# Altium project current_sense.PrjPcb
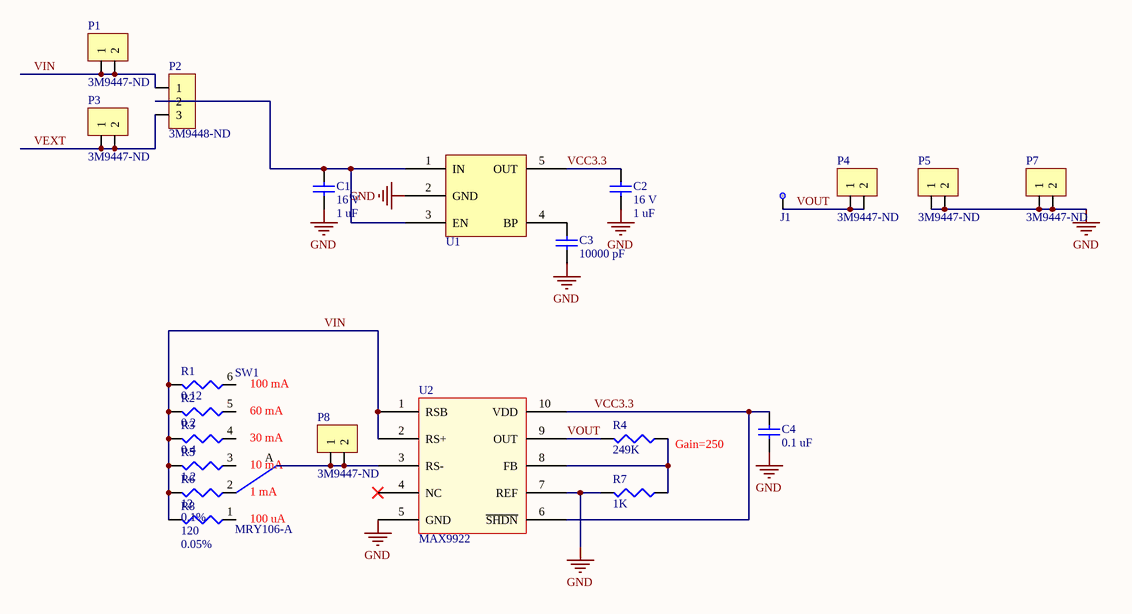
[diagram p0: current_sense.SchDoc]
1 sheet, 23 parts. Net scope: global (net labels, ports and power ports of the same name join across sheets).
Board file: current_sense_v2.PcbDoc

## Sheet current_sense.SchDoc: Current Sense
size Letter; Author: Ye-Sheng Kuo; Revision: 2

### Parts
C1  value 1 uF  voltage rated: 16 V  [0603]  (hidden comment: Ceramic capacitor)
C2  value 1 uF  voltage rated: 16 V  [0603]  (hidden comment: Ceramic capacitor)
C3  value 10000 pF  [0603]  (hidden comment: Ceramic capacitor)
C4  value 0.1 uF  [0603]  (hidden comment: Ceramic capacitor)
J1  5004  [TestPoint]  (value not drawn)
P1  Supplier Part Number 1: 3M9447-ND  [1x2 header]  (hidden comment: 1 x 2 header)
P2  Supplier Part Number 1: 3M9448-ND  [1x3 header]  (hidden comment: 1 x 3 header)
P3  Supplier Part Number 1: 3M9447-ND  [1x2 header]  (hidden comment: 1 x 2 header)
P4  Supplier Part Number 1: 3M9447-ND  [1x2 header]  (hidden comment: 1 x 2 header)
P5  Supplier Part Number 1: 3M9447-ND  [1x2 header]  (hidden comment: 1 x 2 header)
P7  Supplier Part Number 1: 3M9447-ND  [1x2 header]  (hidden comment: 1 x 2 header)
P8  Supplier Part Number 1: 3M9447-ND  [1x2 header]  (hidden comment: 1 x 2 header)
R1  value 0.12  [1206]  (hidden comment: Chip resistor)
R2  value 0.2  [1206]  (hidden comment: Chip resistor)
R3  value 0.4  [1206]  (hidden comment: Chip resistor)
R4  value 249K  [0603]  (hidden comment: Chip resistor)
R5  value 1.2  [0805]  (hidden comment: Chip resistor)
R6  value 12  Tolerance: 0.1%  [0805]  (hidden comment: Chip resistor)
R7  value 1K  [0603]  (hidden comment: Chip resistor)
R8  value 120  Tolerance: 0.05%  [0805]  (hidden comment: Chip resistor)
SW1  MRY106-A  [MRY switch]
U1  LP3985  [SOT23-5]  (value not drawn)
U2  MAX9922  [10umax]

### Nets
GND: C1.2 C2.2 C3.2 C4.2 P5.1 P5.2 P7.1 P7.2 R7.1 U1.2(GND) U2.5(GND) U2.7(REF)
VCC3.3: C2.1 C4.1 U1.5(OUT) U2.6(~{SHDN}) U2.10(VDD)
VEXT: P2.3 P3.1 P3.2
VIN: P1.1 P1.2 P2.1 R1.1 R2.1 R3.1 R5.1 R6.1 R8.1 U2.1(RSB) U2.2(RS+)
VOUT: J1.1(TB) P4.1 P4.2 R4.1 U2.9(OUT)
NetC1_1: C1.1 P2.2 U1.1(IN) U1.3(EN)
NetC3_1: C3.1 U1.4(BP)
NetP8_1: P8.1 P8.2 SW1.A U2.3(RS-)
NetR1_2: R1.2 SW1.6
NetR2_2: R2.2 SW1.5
NetR3_2: R3.2 SW1.4
NetR4_2: R4.2 R7.2 U2.8(FB)
NetR5_2: R5.2 SW1.3
NetR6_2: R6.2 SW1.2
NetR8_2: R8.2 SW1.1

Not connected (* = marked no-connect by the designer): U2 4(NC)*

### Notes on the sheet
- (near SW1) 100 mA
- (near SW1) 60 mA
- (near SW1) 30 mA
- (near R4) Gain=250
- (near SW1) 10 mA
- (near SW1) 1 mA
- (near SW1) 100 uA
- Title
- Date:
- Author:
- Revision:
- Sheet
- of
- University of Michigan
- File:

### Library data of the parts
C1 C2 = C_1u_16V_0603_ceramic: Ceramic capacitor, 1 uF, 16 V, 0603 package; Manufacture: TDK; tolerance: 10%; package: 0603; Supplier 1: Digi-Key; Supplier Part Number 1: 445-1604-1-ND
C3 = C_10000p_25V_0603_ceramic: Ceramic capacitor, 10000 pF, 0603 package; Manufacture: TDK; voltage rated: 25V; tolerance: 10%; package: 0603; Supplier 1: Digi-Key; Supplier Part Number 1: 445-5100-1-ND
C4 = C_0.1u_25V_0603_ceramic: Ceramic capacitor, 0.1 uF, 0603 package; Manufacture: TDK; voltage rated: 25V; tolerance: 10%; package: 0603; Supplier 1: Digi-Key; Supplier Part Number 1: 445-1316-1-ND
J1 = TestPoint: TEST POINT PC MINI .040"D YELLOW; Supplier 1: Digi-Key; Supplier Part Number 1: 5004K-ND; datasheet: http://mail.keyelco.com/ENG._DEPT/PDF%20CAT%20NO%20Drawings/5004.pdf
P1 P3-P5 P7 P8 = 1 x 2 header: 100 mils standard header; Supplier 1: Digi-Key
P2 = 1 x 3 header: 100 mils standard header; Supplier 1: Digi-Key
R1 = R_0.12_1206_1%: Chip resistor, 0.12, 1206 package, current sense; tolerance: 1%; power: 0.5 W; Temperature Coef: 100 ppm; package: 1206; Supplier 1: Digi-Key; Supplier Part Number 1: RL16R.12FCT-ND
R2 = R_0.2_1206_1%: Chip resistor, 0.2, 1206 package, current sense; tolerance: 1%; power: 0.5 W; Temperature Coef: 100 ppm; package: 1206; Supplier 1: Digi-Key; Supplier Part Number 1: CSR1206FKR200CT-ND
R3 = R_0.4_1206_1%: Chip resistor, 0.4, 1206 package, current sense; tolerance: 1%; power: 0.25 W; Temperature Coef: 300 ppm; package: 1206; Supplier 1: Digi-Key; Supplier Part Number 1: 311-.4LWCT-ND
R4 = R_249K_0603_0.1%: Chip resistor, 249 K, 0603 package; tolerance: 0.1%; power: 1/10 W; Temperature Coef: 25 ppm; package: 0603; Supplier 1: Digi-Key; Supplier Part Number 1: P249KDBCT-ND
R5 = R_1.2_0805_1%: Chip resistor, 1.2, 0805 package, current sense; tolerance: 1%; power: 0.333 W; Temperature Coef: 200 ppm; package: 0805; Supplier 1: Digi-Key; Supplier Part Number 1: RL12S1.2FCT-ND
R6 = R_12_0805: Chip resistor, 12, 0805 package, current sense; Temerature Coef: 25 ppm; Power: 0.1 W; package: 0805; Supplier 1: Digi-Key; Supplier Part Number 1: A103150CT-ND
R7 = R_1K_0603_0.1%: Chip resistor, 1 K, 0603 package; tolerance: 0.1%; power: 1/10 W; Temperature Coef: 25 ppm; package: 0603; Supplier 1: Digi-Key; Supplier Part Number 1: P1.0KDBCT-ND
R8 = R_120_0805: Chip resistor, 120, 0805 package, current sense; Temerature Coef: 10 ppm; Power: 0.125 W; package: 0805; Supplier 1: Digi-Key; Supplier Part Number 1: RG20N120WCT-ND
SW1 = MRY106-A: SW ROTARY SP BLK KNOB 125V; Supplier 1: Digi-Key; Supplier Part Number 1: 360-2379-ND
U1 = LP3985: LP3985 Micropower, 150-mA Low-Noise Ultra Low-Dropout CMOS Voltage Regulator; Supplier 1: Digi-Key; Supplier Part Number 1: LP3985IM5-3.3/NOPBCT-ND
U2 = MAX9922: ultra-precision, high-side current-sense amplifier; Supplier 1: Digi-Key; Supplier Part Number 1: MAX9923HEUB+-ND